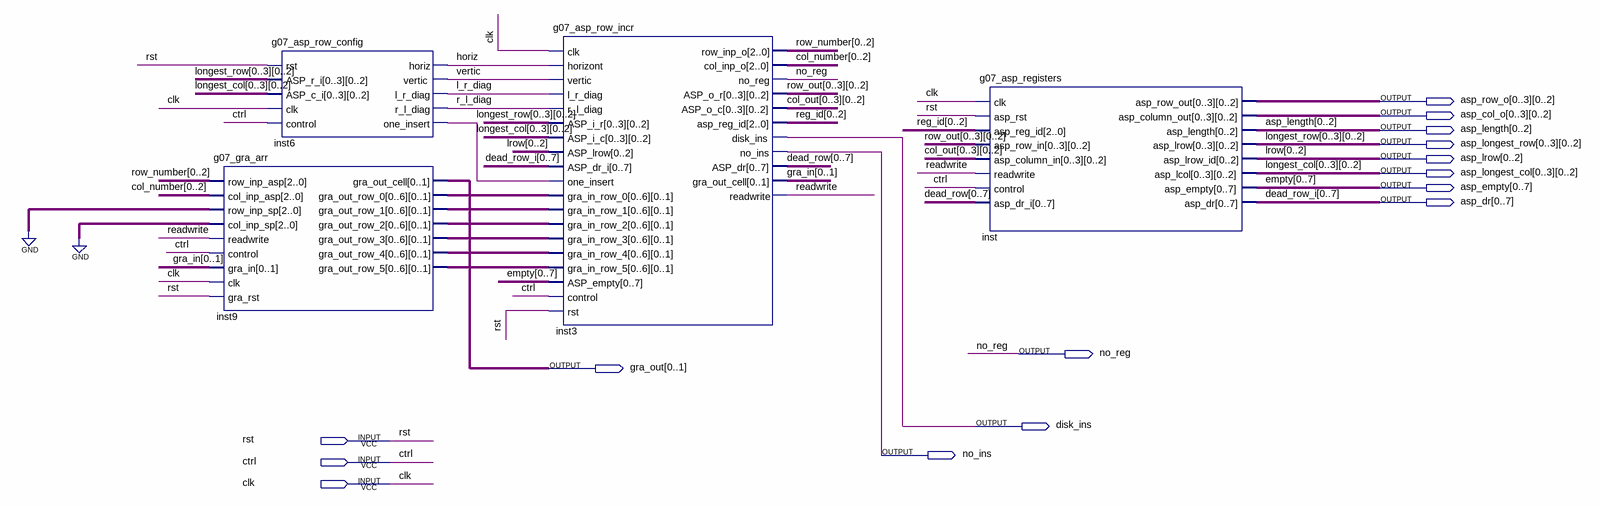
[diagram p0: schematic sheet]
// Quartus schematic g07_asp_next_move.bdf as structural Verilog: 4 symbols, 15 pins
module g07_asp_next_move (
  input  rst,
  input  ctrl,
  input  clk,
  output [2:0] asp_row_o_0,
  output [2:0] asp_row_o_1,
  output [2:0] asp_row_o_2,
  output [2:0] asp_row_o_3,
  output [2:0] asp_col_o_0,
  output [2:0] asp_col_o_1,
  output [2:0] asp_col_o_2,
  output [2:0] asp_col_o_3,
  output [0:2] asp_length,
  output [2:0] asp_longest_row_0,
  output [2:0] asp_longest_row_1,
  output [2:0] asp_longest_row_2,
  output [2:0] asp_longest_row_3,
  output [0:2] asp_lrow,
  output [2:0] asp_longest_col_0,
  output [2:0] asp_longest_col_1,
  output [2:0] asp_longest_col_2,
  output [2:0] asp_longest_col_3,
  output [0:7] asp_empty,
  output [0:7] asp_dr,
  output no_reg,
  output [0:1] gra_out,
  output disk_ins,
  output no_ins
);

  wire horiz, inst6_one_insert, l_r_diag, r_l_diag, readwrite, vertic;
  wire [1:0] gra_in;
  wire [2:0] col_number, col_out_0, col_out_1, col_out_2, col_out_3, reg_id, row_number, row_out_0,
       row_out_1, row_out_2, row_out_3;
  wire [7:0] dead_row;
  wire [13:0] inst9_gra_out_row_0, inst9_gra_out_row_1, inst9_gra_out_row_2, inst9_gra_out_row_3,
       inst9_gra_out_row_4, inst9_gra_out_row_5;

  g07_gra_arr inst9 (
    .row_inp_asp({row_number[0], row_number[1], row_number[2]}),
    .col_inp_asp({col_number[0], col_number[1], col_number[2]}), .row_inp_sp(3'b000), .col_inp_sp(3'b000),
    .readwrite(readwrite), .control(ctrl), .gra_in({gra_in[0], gra_in[1]}), .clk(clk), .gra_rst(rst),
    .gra_out_cell(gra_out), .gra_out_row_0(inst9_gra_out_row_0), .gra_out_row_1(inst9_gra_out_row_1),
    .gra_out_row_2(inst9_gra_out_row_2), .gra_out_row_3(inst9_gra_out_row_3),
    .gra_out_row_4(inst9_gra_out_row_4), .gra_out_row_5(inst9_gra_out_row_5));
  g07_asp_row_config inst6 (
    .rst(rst),
    .ASP_r_i({asp_longest_row_0[0], asp_longest_row_0[1], asp_longest_row_0[2], asp_longest_row_1[0], asp_longest_row_1[1], asp_longest_row_1[2], asp_longest_row_2[0], asp_longest_row_2[1], asp_longest_row_2[2], asp_longest_row_3[0], asp_longest_row_3[1], asp_longest_row_3[2]}),
    .ASP_c_i({asp_longest_col_0[0], asp_longest_col_0[1], asp_longest_col_0[2], asp_longest_col_1[0], asp_longest_col_1[1], asp_longest_col_1[2], asp_longest_col_2[0], asp_longest_col_2[1], asp_longest_col_2[2], asp_longest_col_3[0], asp_longest_col_3[1], asp_longest_col_3[2]}),
    .clk(clk), .control(ctrl), .horiz(horiz), .vertic(vertic), .l_r_diag(l_r_diag), .r_l_diag(r_l_diag),
    .one_insert(inst6_one_insert));
  g07_asp_row_incr inst3 (
    .clk(clk), .horizont(horiz), .vertic(vertic), .l_r_diag(l_r_diag), .r_l_diag(r_l_diag),
    .ASP_i_r({asp_longest_row_0[0], asp_longest_row_0[1], asp_longest_row_0[2], asp_longest_row_1[0], asp_longest_row_1[1], asp_longest_row_1[2], asp_longest_row_2[0], asp_longest_row_2[1], asp_longest_row_2[2], asp_longest_row_3[0], asp_longest_row_3[1], asp_longest_row_3[2]}),
    .ASP_i_c({asp_longest_col_0[0], asp_longest_col_0[1], asp_longest_col_0[2], asp_longest_col_1[0], asp_longest_col_1[1], asp_longest_col_1[2], asp_longest_col_2[0], asp_longest_col_2[1], asp_longest_col_2[2], asp_longest_col_3[0], asp_longest_col_3[1], asp_longest_col_3[2]}),
    .ASP_lrow(asp_lrow), .ASP_dr_i(asp_dr), .one_insert(inst6_one_insert),
    .gra_in_row_0(inst9_gra_out_row_0), .gra_in_row_1(inst9_gra_out_row_1),
    .gra_in_row_2(inst9_gra_out_row_2), .gra_in_row_3(inst9_gra_out_row_3),
    .gra_in_row_4(inst9_gra_out_row_4), .gra_in_row_5(inst9_gra_out_row_5), .ASP_empty(asp_empty),
    .control(ctrl), .rst(rst), .row_inp_o({row_number[0], row_number[1], row_number[2]}),
    .col_inp_o({col_number[0], col_number[1], col_number[2]}), .no_reg(no_reg),
    .ASP_o_r({row_out_0[0], row_out_0[1], row_out_0[2], row_out_1[0], row_out_1[1], row_out_1[2], row_out_2[0], row_out_2[1], row_out_2[2], row_out_3[0], row_out_3[1], row_out_3[2]}),
    .ASP_o_c({col_out_0[0], col_out_0[1], col_out_0[2], col_out_1[0], col_out_1[1], col_out_1[2], col_out_2[0], col_out_2[1], col_out_2[2], col_out_3[0], col_out_3[1], col_out_3[2]}),
    .asp_reg_id({reg_id[0], reg_id[1], reg_id[2]}), .disk_ins(disk_ins), .no_ins(no_ins),
    .ASP_dr({dead_row[0], dead_row[1], dead_row[2], dead_row[3], dead_row[4], dead_row[5], dead_row[6], dead_row[7]}),
    .gra_out_cell({gra_in[0], gra_in[1]}), .readwrite(readwrite));
  g07_asp_registers inst (
    .clk(clk), .asp_rst(rst), .asp_reg_id({reg_id[0], reg_id[1], reg_id[2]}),
    .asp_row_in({row_out_0[0], row_out_0[1], row_out_0[2], row_out_1[0], row_out_1[1], row_out_1[2], row_out_2[0], row_out_2[1], row_out_2[2], row_out_3[0], row_out_3[1], row_out_3[2]}),
    .asp_column_in({col_out_0[0], col_out_0[1], col_out_0[2], col_out_1[0], col_out_1[1], col_out_1[2], col_out_2[0], col_out_2[1], col_out_2[2], col_out_3[0], col_out_3[1], col_out_3[2]}),
    .readwrite(readwrite), .control(ctrl),
    .asp_dr_i({dead_row[0], dead_row[1], dead_row[2], dead_row[3], dead_row[4], dead_row[5], dead_row[6], dead_row[7]}),
    .asp_row_out({asp_row_o_0[0], asp_row_o_0[1], asp_row_o_0[2], asp_row_o_1[0], asp_row_o_1[1], asp_row_o_1[2], asp_row_o_2[0], asp_row_o_2[1], asp_row_o_2[2], asp_row_o_3[0], asp_row_o_3[1], asp_row_o_3[2]}),
    .asp_column_out({asp_col_o_0[0], asp_col_o_0[1], asp_col_o_0[2], asp_col_o_1[0], asp_col_o_1[1], asp_col_o_1[2], asp_col_o_2[0], asp_col_o_2[1], asp_col_o_2[2], asp_col_o_3[0], asp_col_o_3[1], asp_col_o_3[2]}),
    .asp_length(asp_length),
    .asp_lrow({asp_longest_row_0[0], asp_longest_row_0[1], asp_longest_row_0[2], asp_longest_row_1[0], asp_longest_row_1[1], asp_longest_row_1[2], asp_longest_row_2[0], asp_longest_row_2[1], asp_longest_row_2[2], asp_longest_row_3[0], asp_longest_row_3[1], asp_longest_row_3[2]}),
    .asp_lrow_id(asp_lrow),
    .asp_lcol({asp_longest_col_0[0], asp_longest_col_0[1], asp_longest_col_0[2], asp_longest_col_1[0], asp_longest_col_1[1], asp_longest_col_1[2], asp_longest_col_2[0], asp_longest_col_2[1], asp_longest_col_2[2], asp_longest_col_3[0], asp_longest_col_3[1], asp_longest_col_3[2]}),
    .asp_empty(asp_empty), .asp_dr(asp_dr));

  // Other names for the same wires on the sheet: dead_row_i[7:0] = {asp_dr[7], asp_dr[6], asp_dr[5], asp_dr[4], asp_dr[3], asp_dr[2], asp_dr[1], asp_dr[0]};
  //   empty[7:0] = {asp_empty[7], asp_empty[6], asp_empty[5], asp_empty[4], asp_empty[3], asp_empty[2], asp_empty[1], asp_empty[0]};
  //   longest_col_0[2:0] = asp_longest_col_0; longest_col_1[2:0] = asp_longest_col_1;
  //   longest_col_2[2:0] = asp_longest_col_2; longest_col_3[2:0] = asp_longest_col_3;
  //   longest_row_0[2:0] = asp_longest_row_0; longest_row_1[2:0] = asp_longest_row_1;
  //   longest_row_2[2:0] = asp_longest_row_2; longest_row_3[2:0] = asp_longest_row_3;
  //   lrow[2:0] = {asp_lrow[2], asp_lrow[1], asp_lrow[0]}
endmodule
